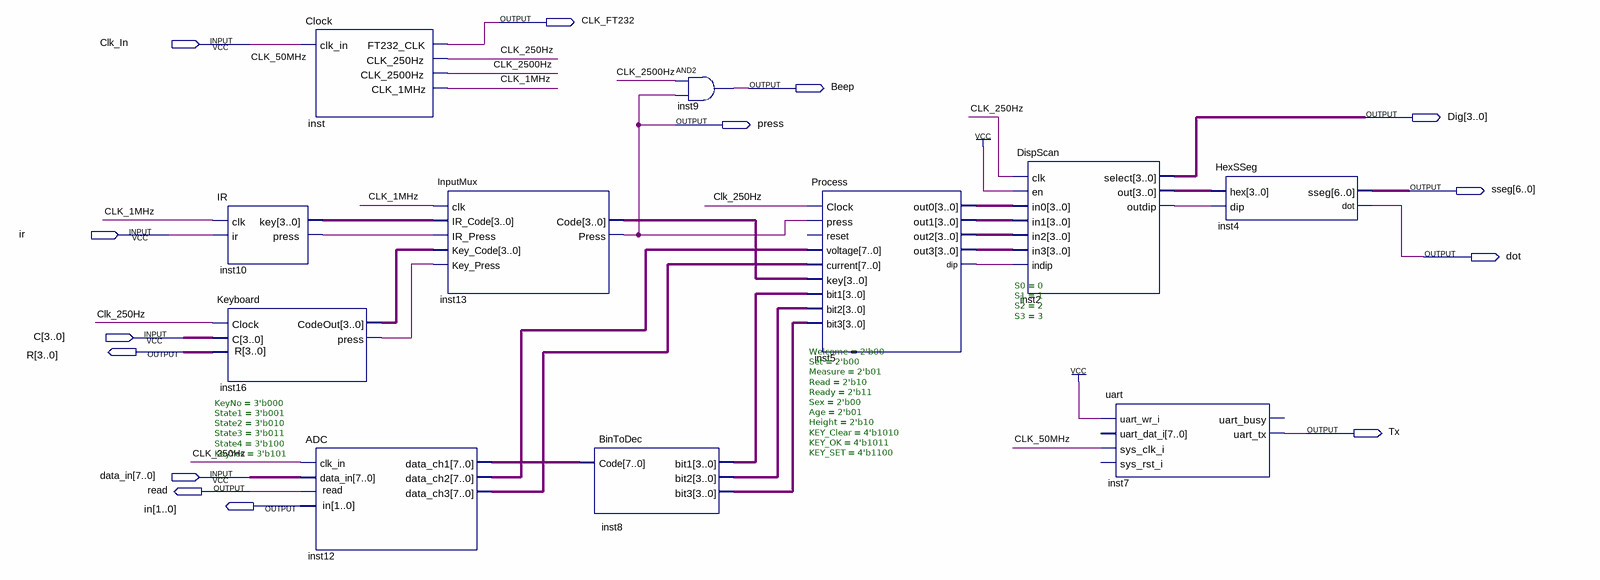
[diagram p0: schematic sheet]
// Quartus schematic Top.bdf as structural Verilog: 11 symbols, 14 pins
module Top (
  input  Clk_In,
  input  ir,
  input  [3:0] C,
  input  [7:0] data_in,
  output CLK_FT232,
  output Beep,
  output [3:0] Dig,
  output press,
  output [6:0] sseg,
  output dot,
  output [3:0] R,
  output Tx,
  output read,
  output [1:0] in
);

  wire CLK_1MHz, CLK_250Hz, CLK_2500Hz, inst2_outdip, inst5_dip, inst10_press, inst16_press;
  wire [3:0] inst2_out, inst5_out0, inst5_out1, inst5_out2, inst5_out3, inst8_bit1, inst8_bit2, inst8_bit3,
       inst10_key, inst13_code, inst16_codeout;
  wire [7:0] inst12_data_ch1, inst12_data_ch2, inst12_data_ch3;

  IR inst10 (.clk(CLK_1MHz), .ir(ir), .key(inst10_key), .press(inst10_press));
  Keyboard #(.KeyNo(3'b000), .State1(3'b001), .State2(3'b010), .State3(3'b011), .State4(3'b100), .KeyYes(3'b101)) inst16 (
    .Clock(CLK_250Hz), .C(C), .press(inst16_press), .CodeOut(inst16_codeout), .R(R));
  Clock inst (
    .clk_in(Clk_In), .FT232_CLK(CLK_FT232), .CLK_250Hz(CLK_250Hz), .CLK_2500Hz(CLK_2500Hz),
    .CLK_1MHz(CLK_1MHz));
  ADC inst12 (
    .clk_in(CLK_250Hz), .data_in(data_in), .read(read), .data_ch1(inst12_data_ch1),
    .data_ch2(inst12_data_ch2), .data_ch3(inst12_data_ch3), .in(in));
  InputMux inst13 (
    .clk(CLK_1MHz), .IR_Code(inst10_key), .Key_Code(inst16_codeout), .IR_Press(inst10_press),
    .Key_Press(inst16_press), .Code(inst13_code), .Press(press));
  BinToDec inst8 (.Code(inst12_data_ch1), .bit1(inst8_bit1), .bit2(inst8_bit2), .bit3(inst8_bit3));
  and inst9 (Beep, CLK_2500Hz, press);
  Process #(.Welcome(2'b00), .Set(2'b00), .Measure(2'b01), .Read(2'b10), .Ready(2'b11), .Sex(2'b00), .Age(2'b01), .Height(2'b10), .KEY_Clear(4'b1010), .KEY_OK(4'b1011), .KEY_SET(4'b1100)) inst5 (
    .Clock(CLK_250Hz), .press(press), .voltage(inst12_data_ch2), .current(inst12_data_ch3),
    .key(inst13_code), .bit1(inst8_bit1), .bit2(inst8_bit2), .bit3(inst8_bit3), .out0(inst5_out0),
    .out1(inst5_out1), .out2(inst5_out2), .out3(inst5_out3), .dip(inst5_dip));  // open: reset
  DispScan #(.S0(0), .S1(1), .S2(2), .S3(3)) inst2 (
    .clk(CLK_250Hz), .en(1'b1), .in0(inst5_out0), .in1(inst5_out1), .in2(inst5_out2), .in3(inst5_out3),
    .indip(inst5_dip), .select(Dig), .out(inst2_out), .outdip(inst2_outdip));
  uart inst7 (.uart_wr_i(1'b1), .sys_clk_i(Clk_In), .uart_tx(Tx));  // open: uart_dat_i, sys_rst_i, uart_busy
  HexSSeg inst4 (.hex(inst2_out), .dip(inst2_outdip), .sseg(sseg), .dot(dot));

  // Other names for the same wires on the sheet: CLK_50MHz = Clk_In
endmodule
